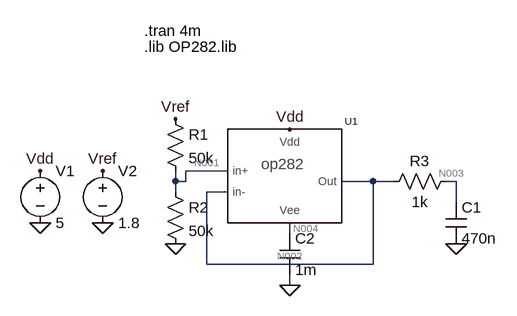
[diagram p0: schematic p2.asc]
p2.asc, the LTspice schematic file:
Version 4
SHEET 1 880 680
WIRE 160 176 96 176
WIRE 80 192 80 176
WIRE 96 192 96 176
WIRE 96 192 80 192
WIRE 384 192 336 192
WIRE 416 192 384 192
WIRE 512 192 496 192
WIRE 80 208 80 192
WIRE 160 208 128 208
WIRE 512 224 512 192
WIRE 256 272 256 256
WIRE 128 320 128 208
WIRE 384 320 384 192
WIRE 384 320 128 320
WIRE 256 352 256 336
FLAG 256 352 0
FLAG -32 256 0
FLAG -128 256 0
FLAG -128 176 Vdd
FLAG -32 176 Vref
FLAG 80 288 0
FLAG 80 96 Vref
FLAG 256 112 Vdd
FLAG 512 288 0
SYMBOL op282 208 192 R0
SYMATTR InstName U1
SYMBOL voltage -128 160 R0
WINDOW 123 0 0 Left 2
WINDOW 39 0 0 Left 2
SYMATTR InstName V1
SYMATTR Value 5
SYMBOL voltage -32 160 R0
WINDOW 123 0 0 Left 2
WINDOW 39 0 0 Left 2
SYMATTR InstName V2
SYMATTR Value 1.8
SYMBOL res 64 80 R0
SYMATTR InstName R1
SYMATTR Value 50k
SYMBOL res 64 192 R0
SYMATTR InstName R2
SYMATTR Value 50k
SYMBOL res 512 176 R90
WINDOW 0 0 56 VBottom 2
WINDOW 3 32 56 VTop 2
SYMATTR InstName R3
SYMATTR Value 1k
SYMBOL cap 496 224 R0
SYMATTR InstName C1
SYMATTR Value 470n
SYMBOL cap 240 272 R0
SYMATTR InstName C2
SYMATTR Value 1m
TEXT 32 -16 Left 2 !.lib OP282.lib
TEXT 32 -40 Left 2 !.tran 4m

The netlist it stands for:
* p2.asc
XU1 N001 N002 Vdd N004 N002 OP282  ; pins in+ in- Vdd Vee Out
V1 Vdd 0 5
V2 Vref 0 1.8
R1 Vref N001 50k
R2 N001 0 50k
R3 N003 N002 1k
C1 N003 0 470n
C2 N004 0 1m
.lib OP282.lib
.tran 4m
.backanno
.end

* Results of the author's LTspice run, read from the files saved beside the schematic
* Operating Point, zero values left out:
*   V(n001) = 3.478 V
*   V(n002) = 4.457 V
*   V(n004) = 3.913 V
*   V(vdd) = 5 V
*   V(vref) = 1.8 V
*   V(n003) = 4.457 V
*   I(R2) = 69.56 µA
*   I(R1) = -33.56 µA
*   I(V2) = 33.56 µA
*   I(V1) = -98.54 µA
*   Ix(u1:1) = -103.1 µA
*   Ix(u1:2) = 7.561 pA
*   Ix(u1:99) = 98.54 µA
*   Ix(u1:30) = -7.994 pA